# Altium schematic sheet Sheet2.SchDoc
size A2; SheetNumber: 2; SheetTotal: 2
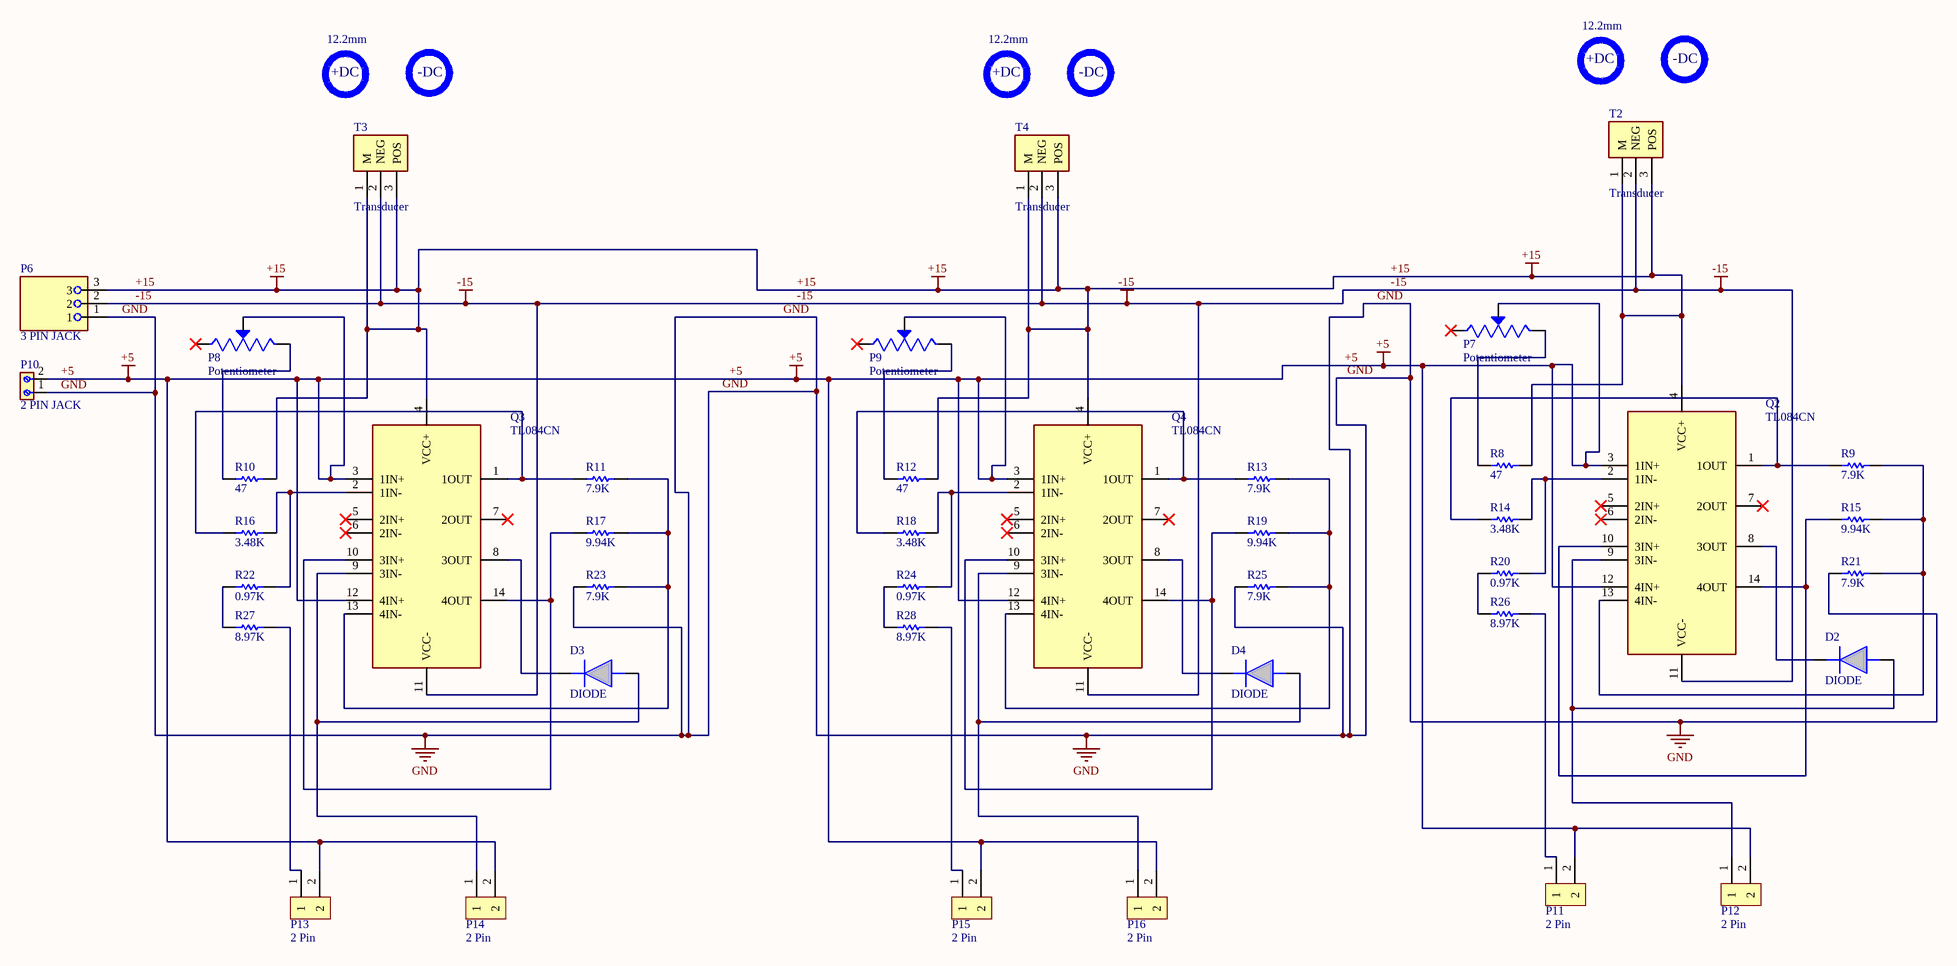
[diagram p0: Sheet2.SchDoc]

## Parts
D2  DIODE  [Diode]
D3  DIODE  [Diode]
D4  DIODE  [Diode]
P6  3 PIN JACK  [3 PIN JACK]
P7  Potentiometer  [Potentiometer]
P8  Potentiometer  [Potentiometer]
P9  Potentiometer  [Potentiometer]
P10  2 PIN JACK  [2 PIN JACK]
P11  2 Pin  [2 PIN]
P12  2 Pin  [2 PIN]
P13  2 Pin  [2 PIN]
P14  2 Pin  [2 PIN]
P15  2 Pin  [2 PIN]
P16  2 Pin  [2 PIN]
Q2  TL084CN  [TL084CN]
Q3  TL084CN  [TL084CN]
Q4  TL084CN  [TL084CN]
R8  47  [47]
R9  7.9K  [7.90K]
R10  47  [47]
R11  7.9K  [7.90K]
R12  47  [47]
R13  7.9K  [7.90K]
R14  3.48K  [3.48K]
R15  9.94K  [9.94K]
R16  3.48K  [3.48K]
R17  9.94K  [9.94K]
R18  3.48K  [3.48K]
R19  9.94K  [9.94K]
R20  0.97K  [0.97K]
R21  7.9K  [7.90K]
R22  0.97K  [0.97K]
R23  7.9K  [7.90K]
R24  0.97K  [0.97K]
R25  7.9K  [7.90K]
R26  8.97K  [8.97K]
R27  8.97K  [8.97K]
R28  8.97K  [8.97K]
T2  Transducer  [Transducer]
T3  Transducer  [Transducer]
T4  Transducer  [Transducer]

## Nets
+5: P7.2(WIPER) P8.2(WIPER) P9.2(WIPER) P10.2 P11.2 P12.2 P13.2 P14.2 P15.2 P16.2 Q2.3(1IN+) Q2.12(4IN+) Q3.3(1IN+) Q3.12(4IN+) Q4.3(1IN+) Q4.12(4IN+)
+15: P6.3 Q2.4(VCC+) Q3.4(VCC+) Q4.4(VCC+) R8.2 R10.2 R12.2 T2.1(M) T2.3(POS) T3.1(M) T3.3(POS) T4.1(M) T4.3(POS)
-15: P6.2 Q2.11(VCC-) Q3.11(VCC-) Q4.11(VCC-) T2.2(NEG) T3.2(NEG) T4.2(NEG)
GND: P6.1 P10.1 R21.1 R23.1 R25.1
NetD2_1: D2.1(K) Q2.8(3OUT)
NetD2_2: D2.2(A) P12.1 Q2.9(3IN-)
NetD3_1: D3.1(K) Q3.8(3OUT)
NetD3_2: D3.2(A) P14.1 Q3.9(3IN-)
NetD4_1: D4.1(K) Q4.8(3OUT)
NetD4_2: D4.2(A) P16.1 Q4.9(3IN-)
NetP7_3: P7.3(CW) R8.1
NetP8_3: P8.3(CW) R10.1
NetP9_3: P9.3(CW) R12.1
NetP11_1: P11.1 R26.2
NetP13_1: P13.1 R27.2
NetP15_1: P15.1 R28.2
NetQ2_1: Q2.1(1OUT) R9.1 R14.1
NetQ2_2: Q2.2(1IN-) R14.2 R20.2
NetQ2_10: Q2.10(3IN+) Q2.14(4OUT) R15.1
NetQ2_13: Q2.13(4IN-) R9.2 R15.2 R21.2
NetQ3_1: Q3.1(1OUT) R11.1 R16.1
NetQ3_2: Q3.2(1IN-) R16.2 R22.2
NetQ3_10: Q3.10(3IN+) Q3.14(4OUT) R17.1
NetQ3_13: Q3.13(4IN-) R11.2 R17.2 R23.2
NetQ4_1: Q4.1(1OUT) R13.1 R18.1
NetQ4_2: Q4.2(1IN-) R18.2 R24.2
NetQ4_10: Q4.10(3IN+) Q4.14(4OUT) R19.1
NetQ4_13: Q4.13(4IN-) R13.2 R19.2 R25.2
NetR20_1: R20.1 R26.1
NetR22_1: R22.1 R27.1
NetR24_1: R24.1 R28.1

Not connected (* = marked no-connect by the designer): P7 1(CCW)*; P8 1(CCW)*; P9 1(CCW)*; Q2 5(2IN+)* 6(2IN-)* 7(2OUT)*; Q3 5(2IN+)* 6(2IN-)* 7(2OUT)*; Q4 5(2IN+)* 6(2IN-)* 7(2OUT)*

## Notes on the sheet
- 12.2mm
- +DC
- -DC

## Library data of the parts
D2-D4 = DIODE: 1N4007S
P11-P16 = 2 Pin: 22272021
R8 R10 R12 = 47: MFR-25FRF52-47R
R9 R11 R13 R21 R23 R25 = 7.9K: MFR-25FBF52-7K87
R14 R16 R18 = 3.48K: MFR-25FBF52-3K48
R15 R17 R19 = 9.94K: MFR-25FTE52-9K76
R20 R22 R24 = 0.97K: MFR-25FRF52-976R
R26-R28 = 8.97K: MFR-25FBF52-8K87
T2-T4 = Transducer: LA55-P